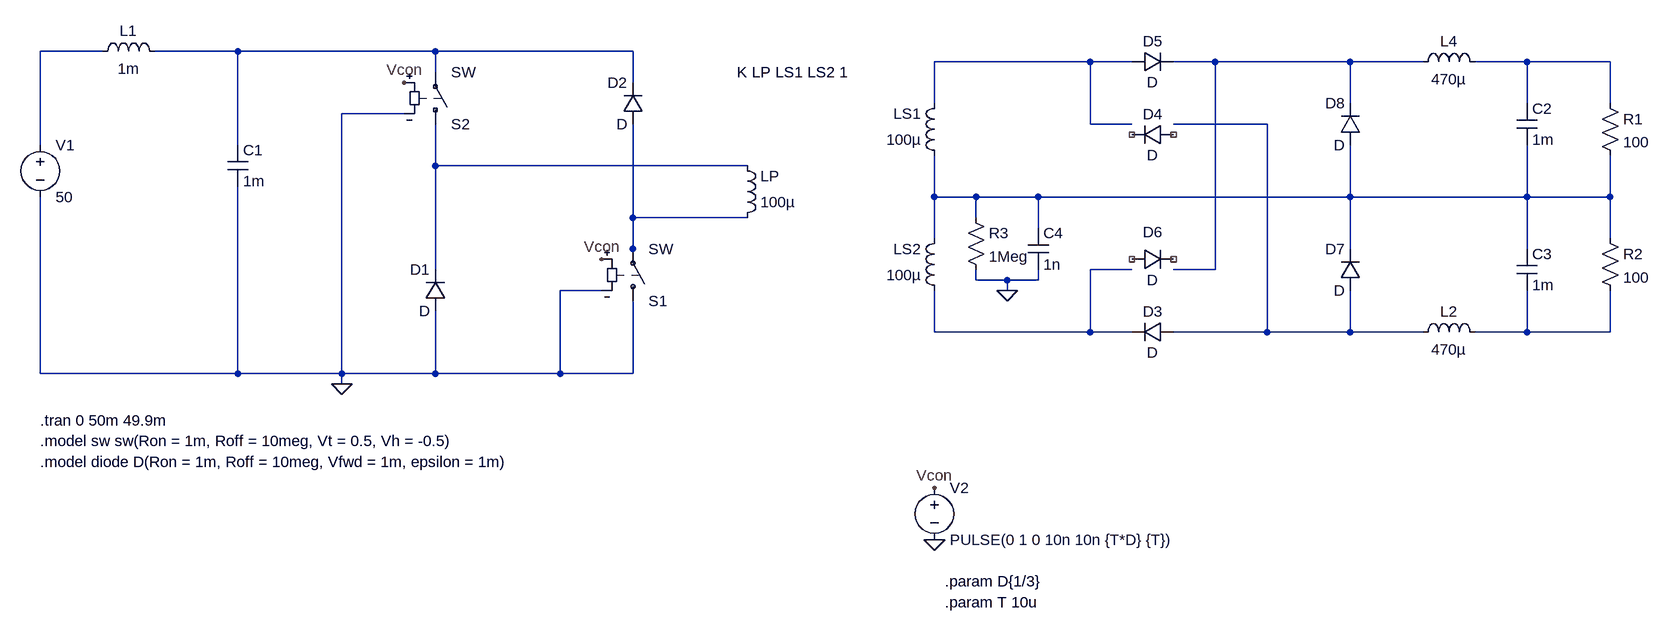
[diagram p0: schematic 2_swtich_forward_converter_split_rail.asc]
2_swtich_forward_converter_split_rail.asc, the LTspice schematic file:
Version 4.1
SHEET 1 2516 816
WIRE 128 -48 32 -48
WIRE 336 -48 208 -48
WIRE 640 -48 336 -48
WIRE 944 -48 640 -48
WIRE 1648 -32 1408 -32
WIRE 1712 -32 1648 -32
WIRE 1840 -32 1776 -32
WIRE 2048 -32 1840 -32
WIRE 2160 -32 2048 -32
WIRE 2320 -32 2240 -32
WIRE 2448 -32 2320 -32
WIRE 640 -16 640 -48
WIRE 944 0 944 -48
WIRE 1408 32 1408 -32
WIRE 2048 32 2048 -32
WIRE 2320 32 2320 -32
WIRE 2448 32 2448 -32
WIRE 592 48 496 48
WIRE 1648 64 1648 -32
WIRE 1712 64 1648 64
WIRE 1920 64 1776 64
WIRE 32 96 32 -48
WIRE 336 96 336 -48
WIRE 640 128 640 64
WIRE 1120 128 640 128
WIRE 1408 176 1408 112
WIRE 1472 176 1408 176
WIRE 1568 176 1472 176
WIRE 2048 176 2048 96
WIRE 2048 176 1568 176
WIRE 2320 176 2320 96
WIRE 2320 176 2048 176
WIRE 2448 176 2448 112
WIRE 2448 176 2320 176
WIRE 944 208 944 64
WIRE 1120 208 944 208
WIRE 1472 208 1472 176
WIRE 1568 224 1568 176
WIRE 1408 240 1408 176
WIRE 2448 240 2448 176
WIRE 944 256 944 208
WIRE 2048 256 2048 176
WIRE 2320 256 2320 176
WIRE 944 272 944 256
WIRE 640 288 640 128
WIRE 1712 288 1648 288
WIRE 1840 288 1840 -32
WIRE 1840 288 1776 288
WIRE 1472 304 1472 288
WIRE 1520 304 1472 304
WIRE 1568 304 1568 288
WIRE 1568 304 1520 304
WIRE 896 320 832 320
WIRE 1520 320 1520 304
WIRE 1408 384 1408 320
WIRE 1648 384 1648 288
WIRE 1648 384 1408 384
WIRE 1712 384 1648 384
WIRE 1920 384 1920 64
WIRE 1920 384 1776 384
WIRE 2048 384 2048 320
WIRE 2048 384 1920 384
WIRE 2160 384 2048 384
WIRE 2320 384 2320 320
WIRE 2320 384 2240 384
WIRE 2448 384 2448 320
WIRE 2448 384 2320 384
WIRE 32 448 32 176
WIRE 336 448 336 160
WIRE 336 448 32 448
WIRE 496 448 496 48
WIRE 496 448 336 448
WIRE 640 448 640 352
WIRE 640 448 496 448
WIRE 832 448 832 320
WIRE 832 448 640 448
WIRE 944 448 944 336
WIRE 944 448 832 448
WIRE 496 464 496 448
FLAG 496 464 0
FLAG 1408 704 0
FLAG 1408 624 Vcon
FLAG 592 0 Vcon
FLAG 896 272 Vcon
FLAG 1520 320 0
SYMBOL voltage 32 80 R0
WINDOW 123 0 0 Left 0
WINDOW 39 0 0 Left 0
SYMATTR InstName V1
SYMATTR Value 50
SYMBOL ind 112 -32 R270
WINDOW 0 32 56 VTop 2
WINDOW 3 5 56 VBottom 2
SYMATTR InstName L1
SYMATTR Value 1m
SYMBOL cap 320 96 R0
SYMATTR InstName C1
SYMATTR Value 1m
SYMBOL ind 1104 224 M180
WINDOW 0 36 80 Left 2
WINDOW 3 36 40 Left 2
SYMATTR InstName LP
SYMATTR Value 100µ
SYMATTR Type ind
SYMBOL ind 1424 128 R180
WINDOW 0 36 80 Left 2
WINDOW 3 36 40 Left 2
SYMATTR InstName LS1
SYMATTR Value 100µ
SYMATTR Type ind
SYMBOL ind 2144 -16 R270
WINDOW 0 32 56 VTop 2
WINDOW 3 5 56 VBottom 2
SYMATTR InstName L4
SYMATTR Value 470µ
SYMBOL cap 2304 32 R0
SYMATTR InstName C2
SYMATTR Value 1m
SYMBOL res 2432 16 R0
SYMATTR InstName R1
SYMATTR Value 100
SYMBOL ind 1424 336 R180
WINDOW 0 36 80 Left 2
WINDOW 3 36 40 Left 2
SYMATTR InstName LS2
SYMATTR Value 100µ
SYMATTR Type ind
SYMBOL ind 2144 400 R270
WINDOW 0 32 56 VTop 2
WINDOW 3 5 56 VBottom 2
SYMATTR InstName L2
SYMATTR Value 470µ
SYMBOL cap 2304 256 R0
SYMATTR InstName C3
SYMATTR Value 1m
SYMBOL res 2432 224 R0
SYMATTR InstName R2
SYMATTR Value 100
SYMBOL diode 1776 368 R90
WINDOW 0 0 32 VBottom 2
WINDOW 3 32 32 VTop 2
SYMATTR InstName D3
SYMBOL diode 1776 64 R90
WINDOW 0 0 32 VBottom 2
WINDOW 3 32 32 VTop 2
SYMATTR InstName D4
SYMBOL diode 1712 -16 R270
WINDOW 0 32 32 VTop 2
WINDOW 3 0 32 VBottom 2
SYMATTR InstName D5
SYMBOL diode 1712 288 R270
WINDOW 0 42 32 VTop 2
WINDOW 3 0 32 VBottom 2
SYMATTR InstName D6
SYMBOL diode 2064 320 R180
WINDOW 0 24 64 Left 2
WINDOW 3 24 0 Left 2
SYMATTR InstName D7
SYMBOL diode 2064 96 R180
WINDOW 0 24 64 Left 2
WINDOW 3 24 0 Left 2
SYMATTR InstName D8
SYMBOL diode 656 352 R180
WINDOW 0 24 64 Left 2
WINDOW 3 24 0 Left 2
SYMATTR InstName D1
SYMBOL diode 960 64 R180
WINDOW 0 24 64 Left 2
WINDOW 3 24 0 Left 2
SYMATTR InstName D2
SYMBOL sw 944 352 M180
SYMATTR InstName S1
SYMBOL sw 640 80 M180
SYMATTR InstName S2
SYMBOL voltage 1408 608 R0
WINDOW 123 0 0 Left 0
WINDOW 39 0 0 Left 0
SYMATTR InstName V2
SYMATTR Value PULSE(0 1 0 10n 10n {T*D} {T})
SYMBOL res 1456 192 R0
SYMATTR InstName R3
SYMATTR Value 1Meg
SYMBOL cap 1552 224 R0
SYMATTR InstName C4
SYMATTR Value 1n
TEXT 1104 -16 Left 2 !K LP LS1 LS2 1
TEXT 32 520 Left 2 !.tran 0 50m 49.9m
TEXT 1424 768 Left 2 !.param D{1/3}
TEXT 1424 800 Left 2 !.param T 10u
TEXT 32 552 Left 2 !.model sw sw(Ron = 1m, Roff = 10meg, Vt = 0.5, Vh = -0.5)
TEXT 32 584 Left 2 !.model diode D(Ron = 1m, Roff = 10meg, Vfwd = 1m, epsilon = 1m)

The netlist it stands for:
* 2_swtich_forward_converter_split_rail.asc
V1 N001 0 50
L1 N001 N002 1m
C1 N002 0 1m
LP N009 N007 100µ
LS1 N008 N003 100µ
L4 N004 N005 470µ
C2 N005 N008 1m
R1 N005 N008 100
LS2 N010 N008 100µ
L2 N006 N011 470µ
C3 N008 N011 1m
R2 N008 N011 100
D3 N006 N010 D
D4 NC_01 NC_02 D
D5 N003 N004 D
D6 NC_03 NC_04 D
D7 N006 N008 D
D8 N008 N004 D
D1 0 N007 D
D2 N009 N002 D
S1 0 N009 Vcon 0 SW
S2 N007 N002 Vcon 0 SW
V2 Vcon 0 PULSE(0 1 0 10n 10n {T*D} {T})
R3 N008 0 1Meg
C4 N008 0 1n
.model D D
.lib standard.dio
K LP LS1 LS2 1
.tran 0 50m 49.9m
.param D{1/3}
.param T 10u
.model sw sw(Ron = 1m, Roff = 10meg, Vt = 0.5, Vh = -0.5)
.model diode D(Ron = 1m, Roff = 10meg, Vfwd = 1m, epsilon = 1m)
.backanno
.end